# EasyEDA Pro project STM32单片机家电控制及家居环境监测系统.epro

# Schematic Schematic1
Assembly Variant: Basic; Board Name: Board1; Create Date: 2026-02-08; Page Name: P1; Project Name: STM32单片机家电控制及家居环境监测系统; Schematic Name: Schematic1; Update Date: 2026-02-09; BladeWidth: 10; Company: 嘉立创EDA; Page Size: A4; RegionStart: 1; ShowBorder: 1; TitleBlock: 1; TitleBlockPosition: 3; Version: V1.0; XRegionCount: 6; YRegionCount: 4
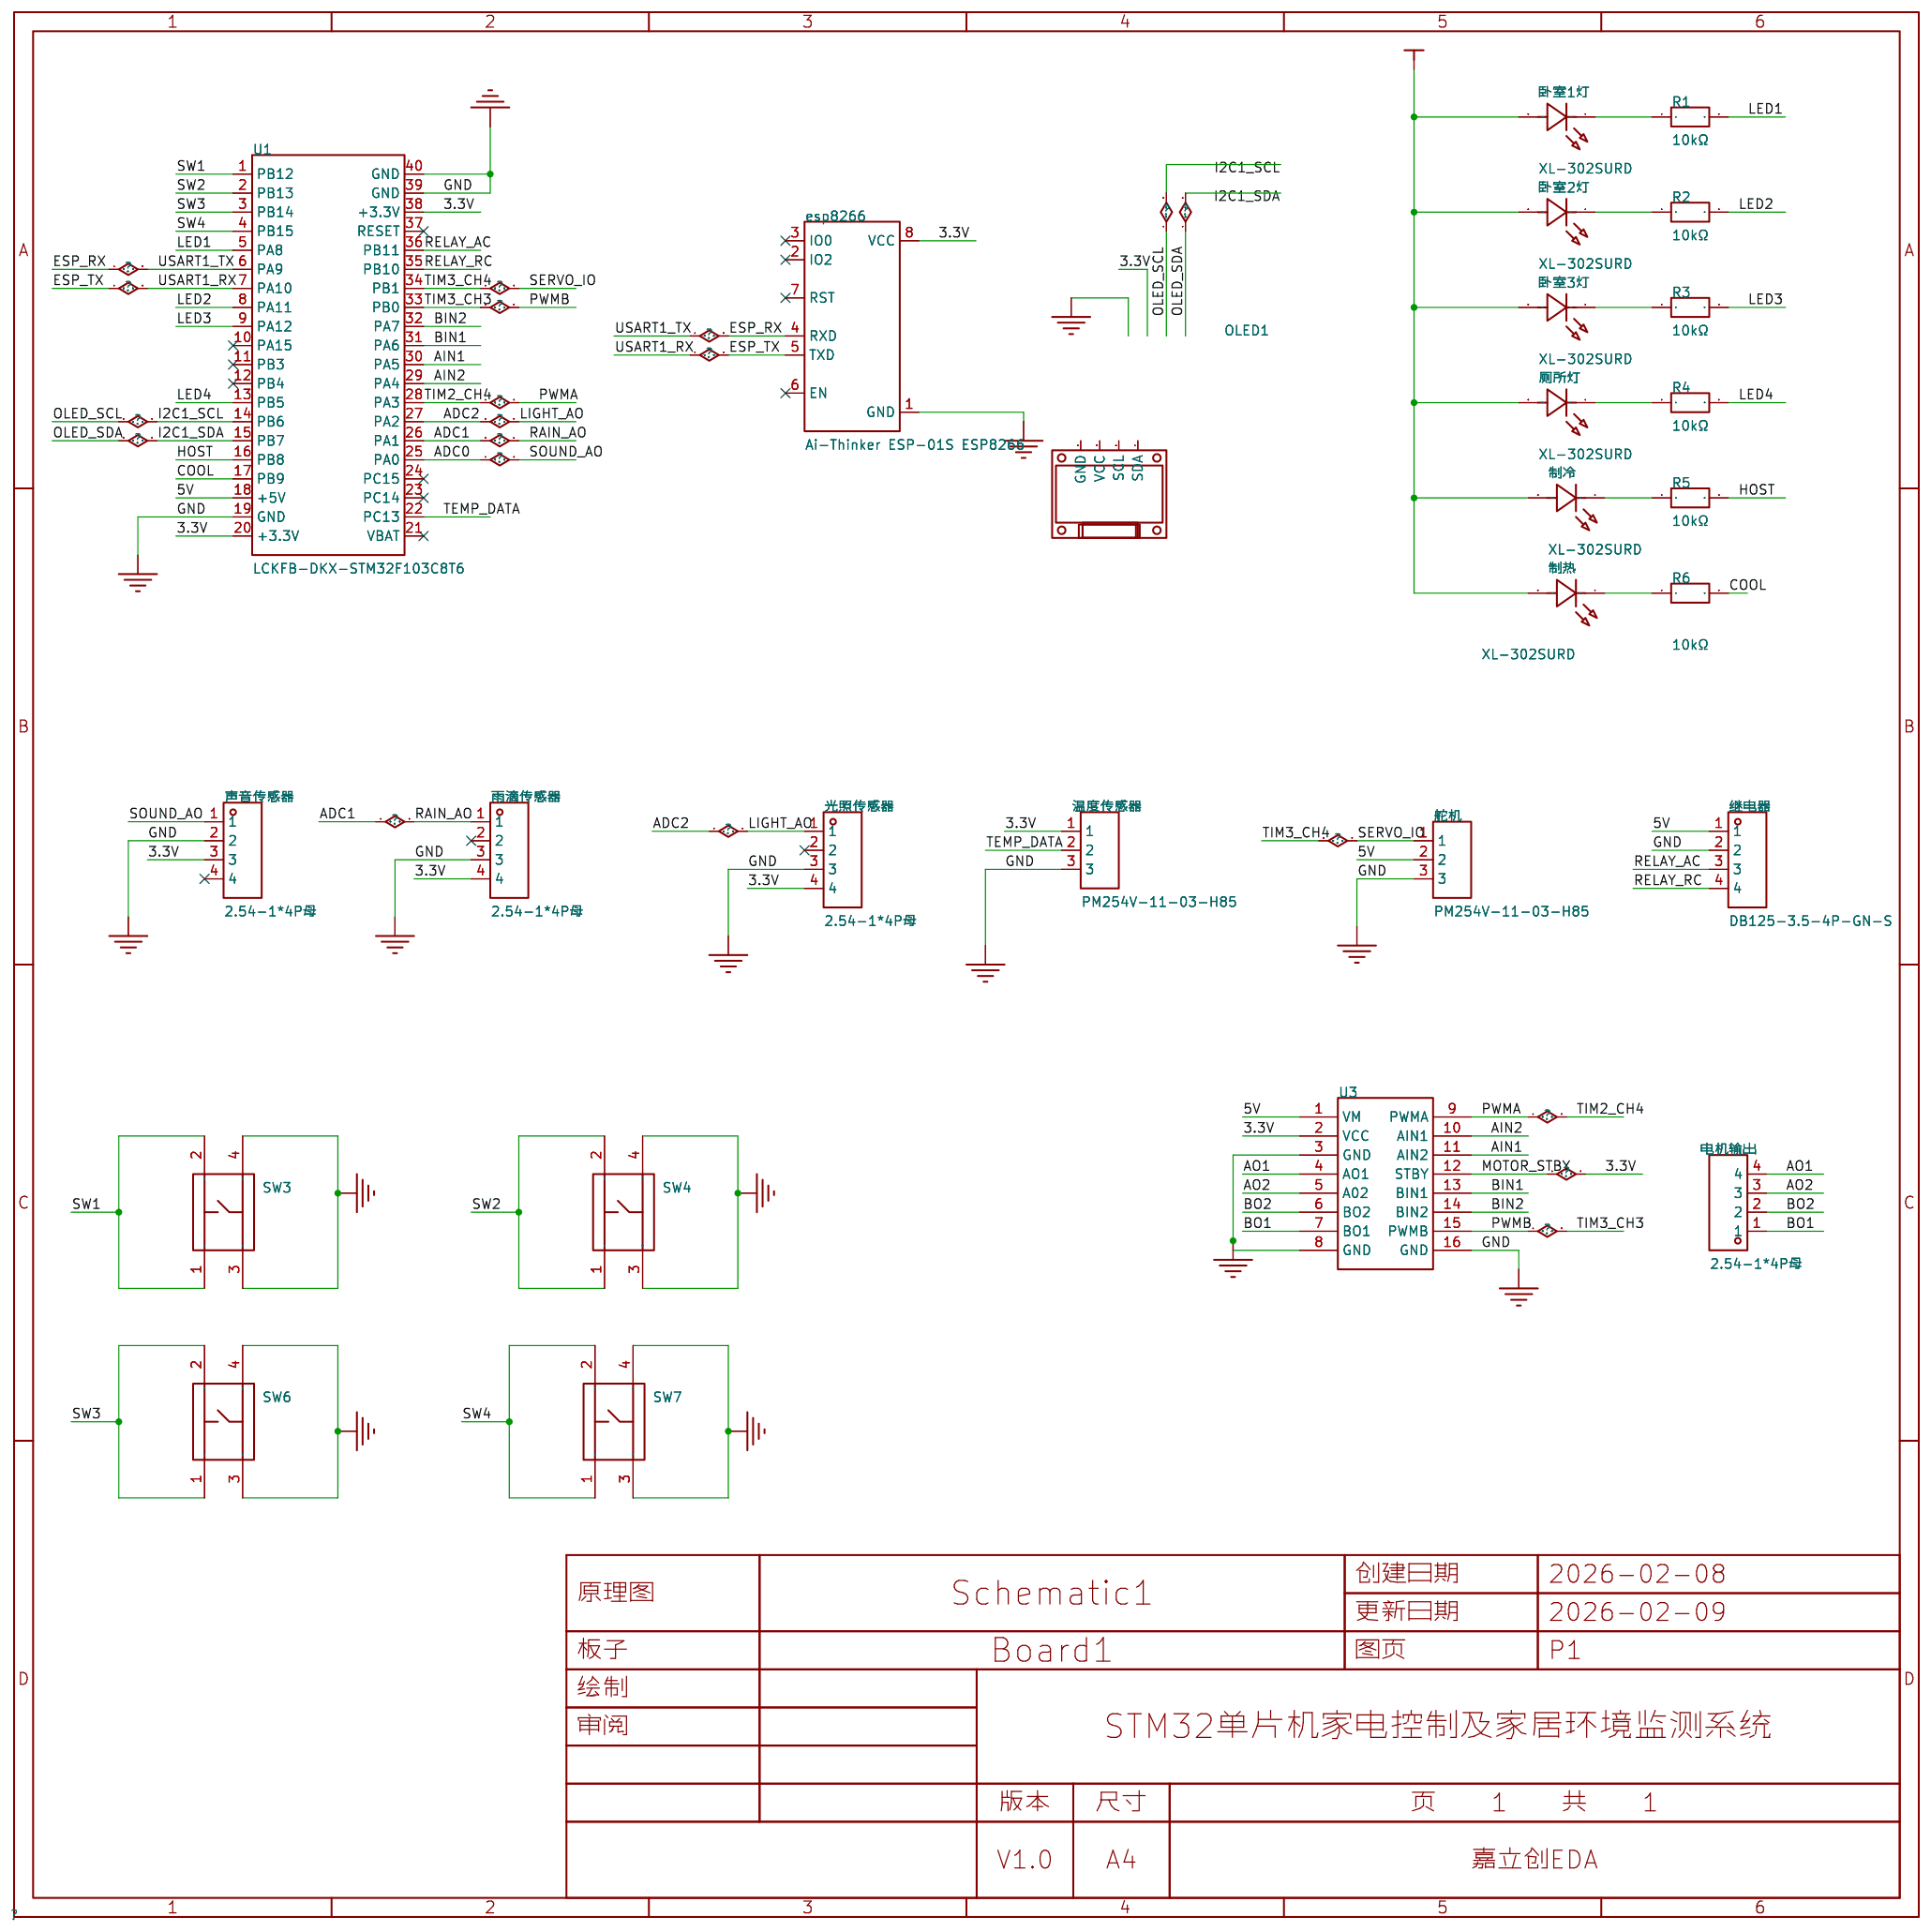
[diagram p0: schematic sheet]

## Parts
esp8266  Ai-Thinker ESP-01S ESP8266  [WIFIM-TH_8P-L24.7-W14.4-P2.54]
OLED1  -  [0.96OLED_4P]
R1  10kΩ  [RES-TH_BD2.7-L6.2-P10.20-D0.4]
R2  10kΩ  [RES-TH_BD2.7-L6.2-P10.20-D0.4]
R3  10kΩ  [RES-TH_BD2.7-L6.2-P10.20-D0.4]
R4  10kΩ  [RES-TH_BD2.7-L6.2-P10.20-D0.4]
R5  10kΩ  [RES-TH_BD2.7-L6.2-P10.20-D0.4]
R6  10kΩ  [RES-TH_BD2.7-L6.2-P10.20-D0.4]
SW3  K2-1102DP-C4SW-04  [KEY-TH_4P-L6.0-W6.0-P4.50-LS6.50]
SW4  K2-1102DP-C4SW-04  [KEY-TH_4P-L6.0-W6.0-P4.50-LS6.50]
SW6  K2-1102DP-C4SW-04  [KEY-TH_4P-L6.0-W6.0-P4.50-LS6.50]
SW7  K2-1102DP-C4SW-04  [KEY-TH_4P-L6.0-W6.0-P4.50-LS6.50]
U1  LCKFB-DKX-STM32F103C8T6  [CONN-TH_L53.3-W22.9_STM32F103C8T6-CARD]
U3  -  [TB6612]
光照传感器  2.54-1*4P母  [HDR-TH_4P-P2.54-V-F]
制冷  XL-302SURD  [LED-TH_BD3.8-P2.54-RD]
制热  XL-302SURD  [LED-TH_BD3.8-P2.54-RD]
卧室1灯  XL-302SURD  [LED-TH_BD3.8-P2.54-RD]
卧室2灯  XL-302SURD  [LED-TH_BD3.8-P2.54-RD]
卧室3灯  XL-302SURD  [LED-TH_BD3.8-P2.54-RD]
厕所灯  XL-302SURD  [LED-TH_BD3.8-P2.54-RD]
声音传感器  2.54-1*4P母  [HDR-TH_4P-P2.54-V-F]
温度传感器  PM254V-11-03-H85  [HDR-TH_3P-P2.54-V-F]
电机输出  2.54-1*4P母  [HDR-TH_4P-P2.54-V-F]
继电器  DB125-3.5-4P-GN-S  [CONN-TH_DB125-3.5-4P-GN]
舵机  PM254V-11-03-H85  [HDR-TH_3P-P2.54-V-F]
雨滴传感器  2.54-1*4P母  [HDR-TH_4P-P2.54-V-F]

## Library data of the parts
esp8266 = Ai-Thinker ESP-01S ESP8266: Supplier Part: C17606792; Manufacturer: Ai-Thinker(安信可); JLCPCB Part Class: Extended Part; Datasheet: https://item.szlcsc.com/datasheet/Ai-Thinker%2520ESP-01S%2520ESP8266/18736031.html; Supplier: LCSC
OLED1 = 0.96OLED模块_4P: Supplier Footprint: 插件
R1-R6 = MF1/4W-10K±1%-ST52: 电阻类型:金属膜电阻;阻值:10kΩ;精度:±1%;功率:250mW;温度系数:±100ppm/℃;; LCSC Part Name: 金属膜电阻 10kΩ ±1% 250mW; Supplier Part: C2903232; Manufacturer: VO(翔胜); Supplier Footprint: 插件,D2.7xL6.2mm; JLCPCB Part Class: Extended Part; Datasheet: https://item.szlcsc.com/datasheet/MF1%252F4W-10K%25C2%25B11%2525-ST52/3158983.html; Supplier: LCSC; Type: 金属膜电阻; Tolerance: ±1%; Voltage-Supply(Max): 250V; Power(Watts): 250mW; Temperature Coefficient: ±100ppm/℃; Operating Temperature: -55℃~+155℃
SW3 SW4 SW6 SW7 = K2-1102DP-C4SW-04: 电路结构:单刀单掷;按钮形状:圆形按钮;作用力:2.5N;安装方式:直插;开关长度:6mm;开关宽度:6mm;开关高度:5mm;触点电流:50mA;额定电压:12V;带灯:-;工作寿命:10万次;; LCSC Part Name: 轻触按键开关6*6*5; Supplier Part: C110153; Manufacturer: 韩国韩荣; Supplier Footprint: 插件-4P,6x6mm; JLCPCB Part Class: Extended Part; Datasheet: https://item.szlcsc.com/datasheet/K2-1102DP-C4SW-04/111374.html; Supplier: LCSC; Circuit: 单刀单掷; Actuator Style: 圆形按钮; Operating Force: 2.5N; Mounting Type: 直插; Length: 6mm; Width: 6mm; Switch Height: 5mm; Contact Current: 50mA; Voltage Rating: 12V; Life: 10万次; Operating Temperature: -25℃~+85℃
U1 = LCKFB-DKX-STM32F103C8T6: 搭载Contex M3内核,程序存储容量64KB,RAM总容量20KB,最高72MHz主频,提供高效的计算能力和稳定的运行环境。; LCSC Part Name: 立创·地阔星-STM32F103C8T6开发板; Supplier Part: C22396880; Manufacturer: 立创开发板; JLCPCB Part Class: Extended Part; Datasheet: https://item.szlcsc.com/datasheet/LCKFB-DKX-STM32F103C8T6/24005615.html; Supplier: LCSC
U3 = TB6612
光照传感器 声音传感器 电机输出 雨滴传感器 = 2.54-1*4P母: 插孔结构:1x4P;间距:2.54mm;行距:-;圆孔/方孔:方孔;安装方式:直插;排数:单排;总孔位数:4P;额定电流:3A;额定电压:-;插孔方向:顶部;塑高:-;触头材质:青铜;触头镀层:-;工作温度:-40℃~+105℃;; LCSC Part Name: 间距:2.54mm 1x4P 直插; Supplier Part: C2718488; Manufacturer: BOOMELE(博穆精密); Supplier Footprint: 插件,P=2.54mm; JLCPCB Part Class: Extended Part; Datasheet: https://item.szlcsc.com/datasheet/2.54-1*4P%25E6%25AF%258D/2834502.html; Supplier: LCSC; Holes Structure: 1x4P; Pitch: 2.54mm; Circular Hole / Square Hole: 方孔; Mounting Type: 直插; Number of Rows: 单排; Number of Positions: 4P; Current Rating: 3A; Holes Direction: 顶部; Contact Material: 青铜; Operating Temperature: -40℃~+105℃
制冷 制热 卧室1灯 卧室2灯 卧室3灯 厕所灯 = XL-302SURD: 灯头类型:3mm圆形灯头;发光颜色:红色;正向压降(Vf):2.2V;功率:50mW;正向电流:20mA;波长:620nm~630nm;二极管配置:-;透镜颜色:红色透镜;色温:-;发光强度:1000mcd;发光角度:35°;载带方式:-;工作温度:-20℃~+85℃;; LCSC Part Name: 3mm圆形灯头 红色; Supplier Part: C2895470; Manufacturer: XINGLIGHT(成兴光); Supplier Footprint: 插件,D=3mm; JLCPCB Part Class: Extended Part; Datasheet: https://item.szlcsc.com/datasheet/XL-302SURD/3136185.html; Supplier: LCSC; Lamp Holder Type: 3mm圆形灯头; Illumination Color: 红色; Voltage - Forward(Vf): 2.2V; Power(Watts): 50mW; Forward Current: 20mA; Wavelength - Dominant: 620nm~630nm; Peak Wavelength: 625nm; Lens Color: 红色透镜; Luminous Intensity: 1000mcd; Viewing Angle: 35°; Operating Temperature: -20℃~+85℃
温度传感器 舵机 = PM254V-11-03-H85: 插孔结构:1x3P;间距:2.54mm;行距:-;圆孔/方孔:方孔;安装方式:直插;排数:单排;总孔位数:3P;额定电流:3A;插孔方向:顶部;塑高:8.5mm;触头材质:黄铜;触头镀层:-;工作温度:-40℃~+105℃;; LCSC Part Name: 1x3P 间距:2.54mm 直插; Supplier Part: C541850; Manufacturer: XFCN(兴飞); Supplier Footprint: 插件,P=2.54mm; JLCPCB Part Class: Extended Part; Datasheet: https://item.szlcsc.com/datasheet/PM254V-11-03-H85/562471.html; Supplier: LCSC; Holes Structure: 1x3P; Pitch: 2.54mm; Circular Hole / Square Hole: 方孔; Mounting Type: 直插; Number of Rows: 单排; Number of Positions: 3P; Current Rating: 3A; Holes Direction: 顶部; Insulation Height: 8.5mm; Contact Material: 黄铜; Operating Temperature: -40℃~+105℃
继电器 = DB125-3.5-4P-GN-S: 结构:1x4P;间距:3.5mm;颜色:绿色;安装方式:直插;排数:1;每排PIN数:4;额定电流:10A;额定电压:300V;线规 - AWG:16~28;线规 - 平方毫米:1;工作温度:-40℃~+105℃;; LCSC Part Name: 1x4P 3.5mm 直插 排数:1 每排P数:4; Supplier Part: C2757925; Manufacturer: DORABO(地博电气); Supplier Footprint: 插件,P=3.5mm; JLCPCB Part Class: Extended Part; Datasheet: https://item.szlcsc.com/datasheet/DB125-3.5-4P-GN-S/2874766.html; Supplier: LCSC; Number of Positions or Pins: 1x4P; Pitch: 3.5mm; Color: 绿色; Mounting Type: 直插; Number of Pins: 4P; Number of Rows: 1; Number of PINs Per Row: 4; Screw Specification: M2; Current Rating: 10A; Voltage Rating (Max): 300V; Wire Gauge - AWG: 16~28; Wire Gauge - mm2: 1; Operating Temperature: -40℃~+105℃

## Nets
3.3V: esp8266.8(VCC) U1.20(+3.3V) U1.38(+3.3V) U3.2(VCC) U3.12(STBY) 光照传感器.4 制冷.2(A) 制热.2(A) 卧室1灯.2(A) 卧室2灯.2(A) 卧室3灯.2(A) 厕所灯.2(A) 声音传感器.3 温度传感器.1 雨滴传感器.4
5V: U1.18(+5V) U3.1(VM) 继电器.1 舵机.2
GND: esp8266.1(GND) SW3.3 SW3.4 SW4.3 SW4.4 SW6.3 SW6.4 SW7.3 SW7.4 U1.19(GND) U1.39(GND) U1.40(GND) U3.3(GND) U3.8(GND) U3.16(GND) 光照传感器.3 声音传感器.2 温度传感器.3 继电器.2 舵机.3 雨滴传感器.3
ADC0: U1.25(PA0) 声音传感器.1
ADC1: U1.26(PA1) 雨滴传感器.1
ADC2: U1.27(PA2) 光照传感器.1
AIN1: U1.30(PA5) U3.11(AIN2)
AIN2: U1.29(PA4) U3.10(AIN1)
AO1: U3.4(AO1) 电机输出.4
AO2: U3.5(A02) 电机输出.3
BIN1: U1.31(PA6) U3.13(BIN1)
BIN2: U1.32(PA7) U3.14(BIN2)
BO1: U3.7(BO1) 电机输出.1
BO2: U3.6(BO2) 电机输出.2
COOL: R6.2 U1.17(PB9)
ESP_RX: esp8266.4(RXD) U1.6(PA9)
ESP_TX: esp8266.5(TXD) U1.7(PA10)
HOST: R5.2 U1.16(PB8)
I2C1_SCL: U1.14(PB6)
I2C1_SDA: U1.15(PB7)
LED1: R1.2 U1.5(PA8)
LED2: R2.2 U1.8(PA11)
LED3: R3.2 U1.9(PA12)
LED4: R4.2 U1.13(PB5)
PWMA: U1.28(PA3) U3.9(PWMA)
PWMB: U1.33(PB0) U3.15(PWMB)
RELAY_AC: U1.36(PB11) 继电器.3
RELAY_RC: U1.35(PB10) 继电器.4
SERVO_IO: U1.34(PB1) 舵机.1
SW1: SW3.1 SW3.2 U1.1(PB12)
SW2: SW4.1 SW4.2 U1.2(PB13)
SW3: SW6.1 SW6.2 U1.3(PB14)
SW4: SW7.1 SW7.2 U1.4(PB15)
TEMP_DATA: U1.22(PC13) 温度传感器.2
$1N176: R4.1 厕所灯.1(K)
$1N177: R3.1 卧室3灯.1(K)
$1N178: R1.1 卧室1灯.1(K)
$1N179: R2.1 卧室2灯.1(K)
$1N193: R5.1 制冷.1(K)
$1N194: R6.1 制热.1(K)

Not connected (* = marked no-connect by the designer): esp8266 2(IO2)* 3(IO0)* 6(EN)* 7(RST)*; OLED1 1(GND) 2(VCC) 3(SCL) 4(SDA); U1 10(PA15)* 11(PB3)* 12(PB4)* 21(VBAT)* 23(PC14)* 24(PC15)* 37(RESET)*; 光照传感器 2*; 声音传感器 4*; 雨滴传感器 2*

# Board PCB1
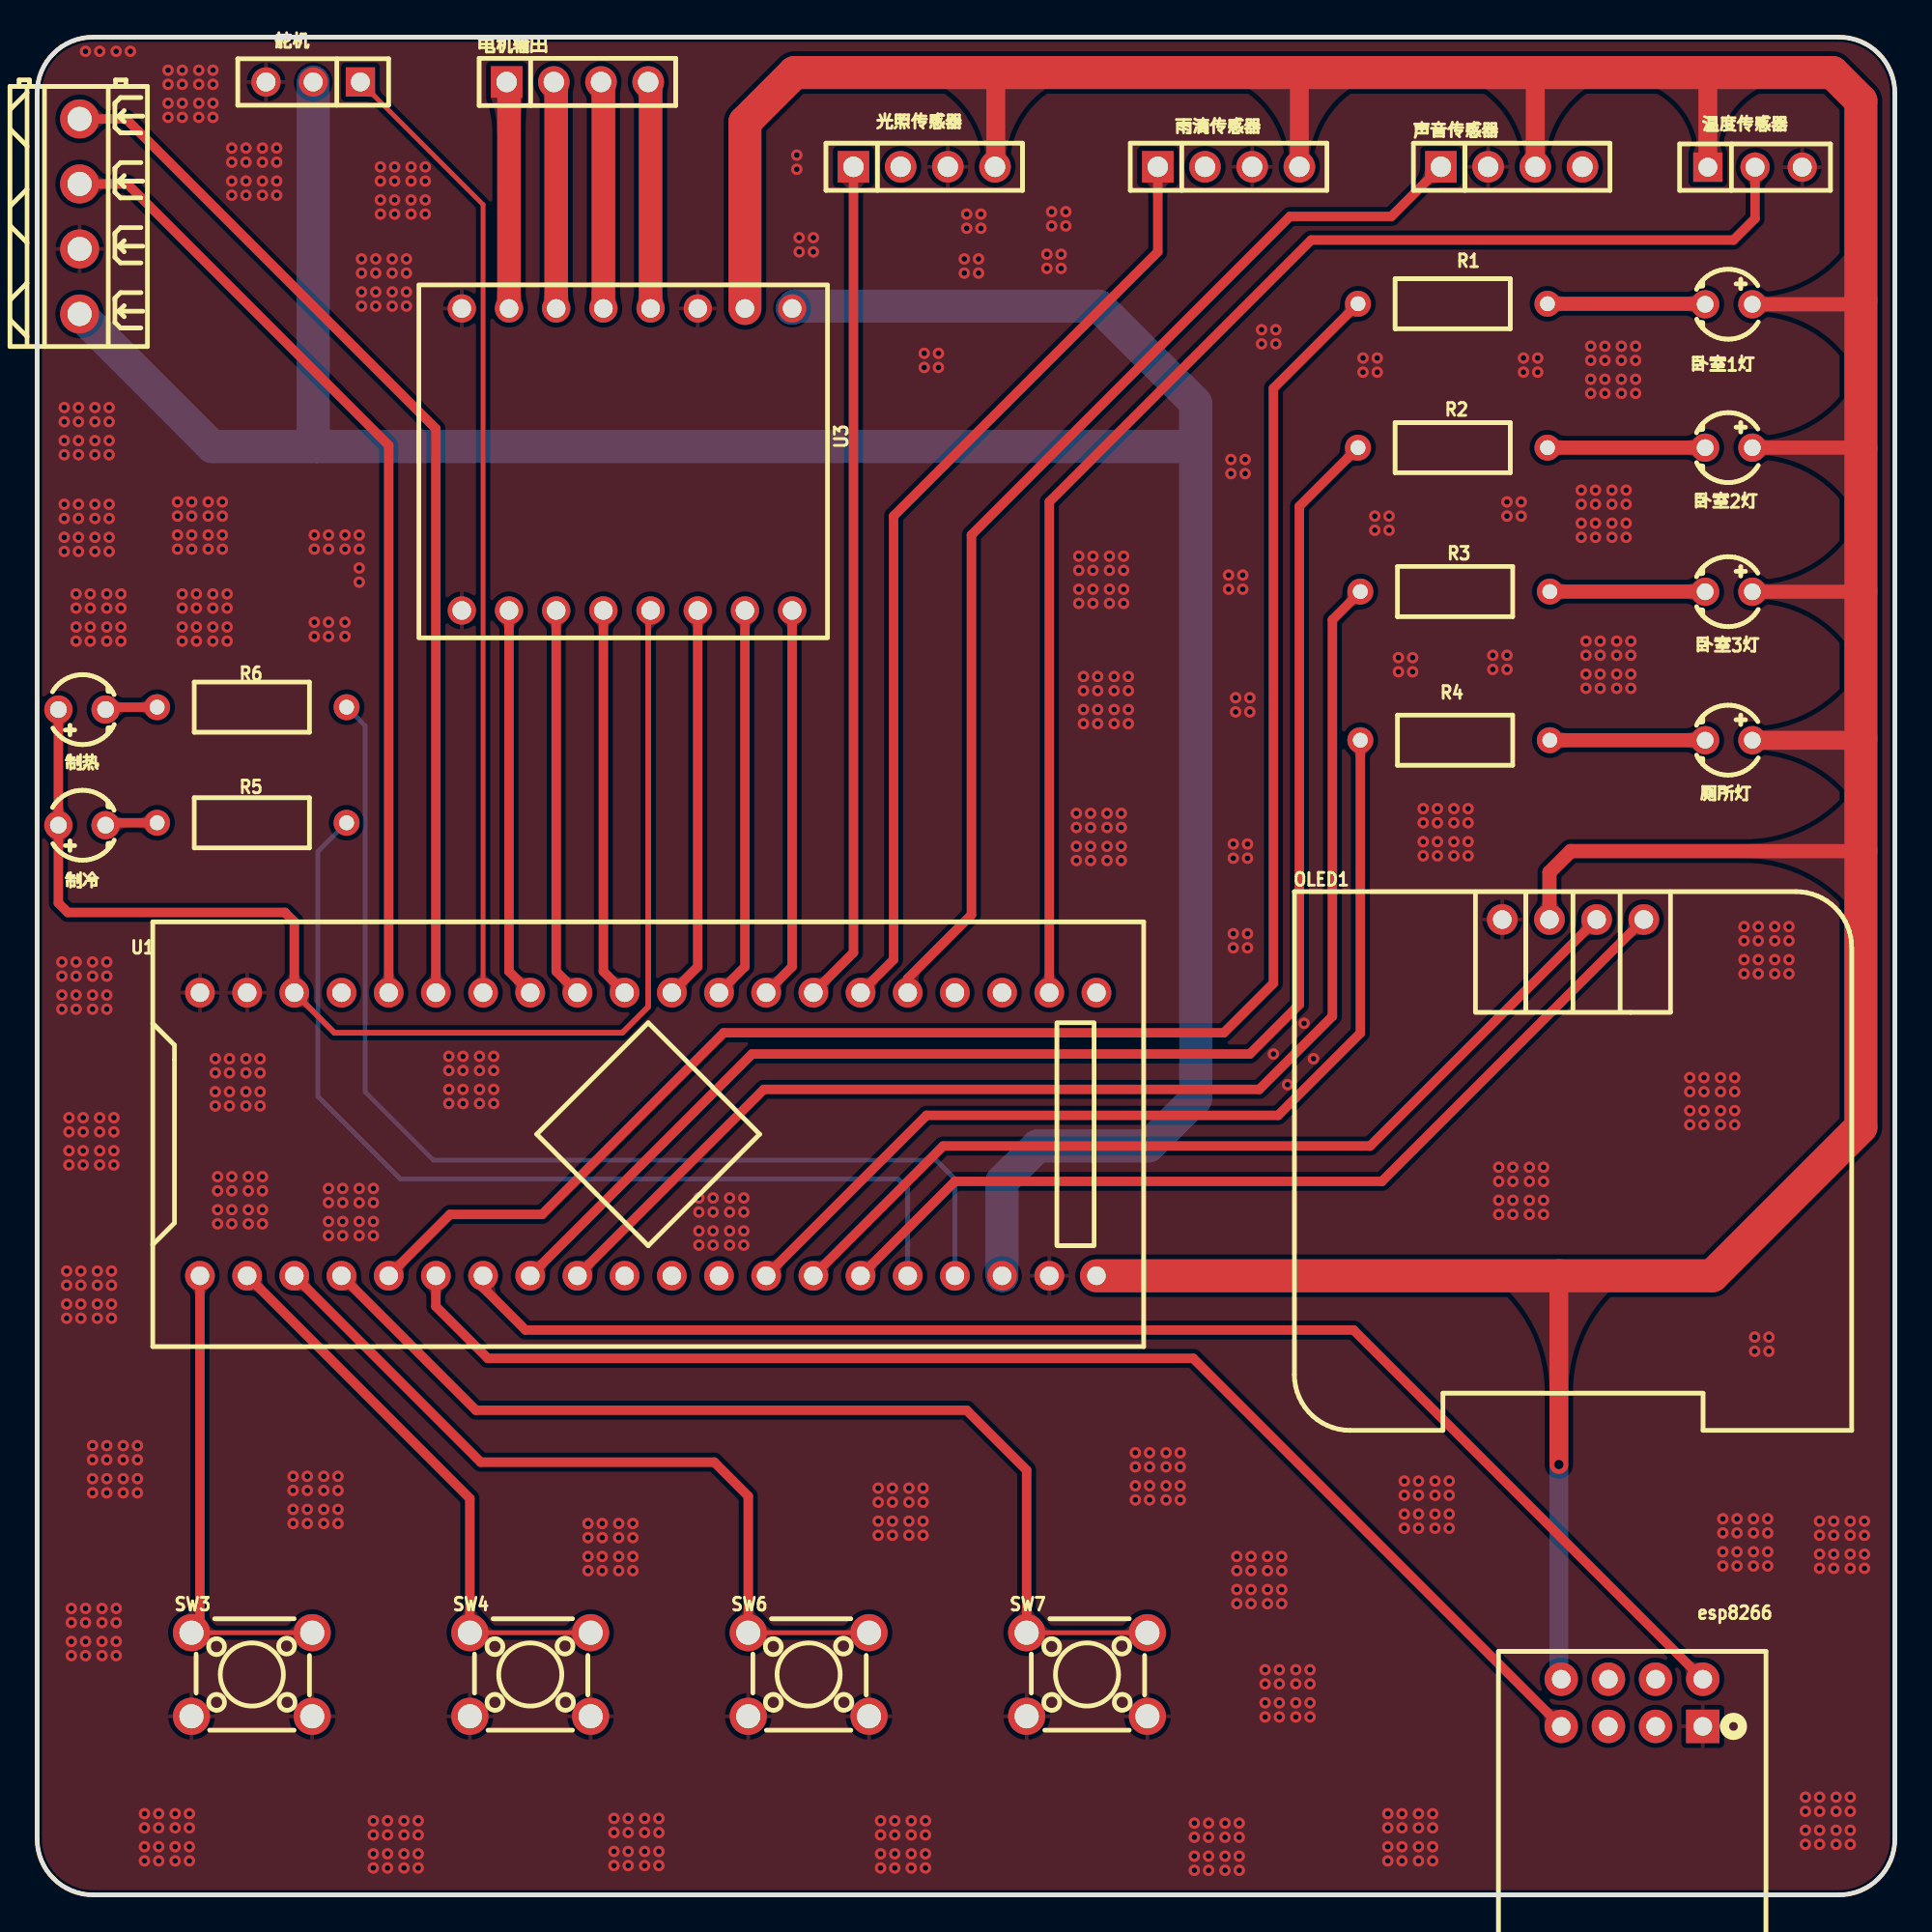
[diagram p1: board, top side]
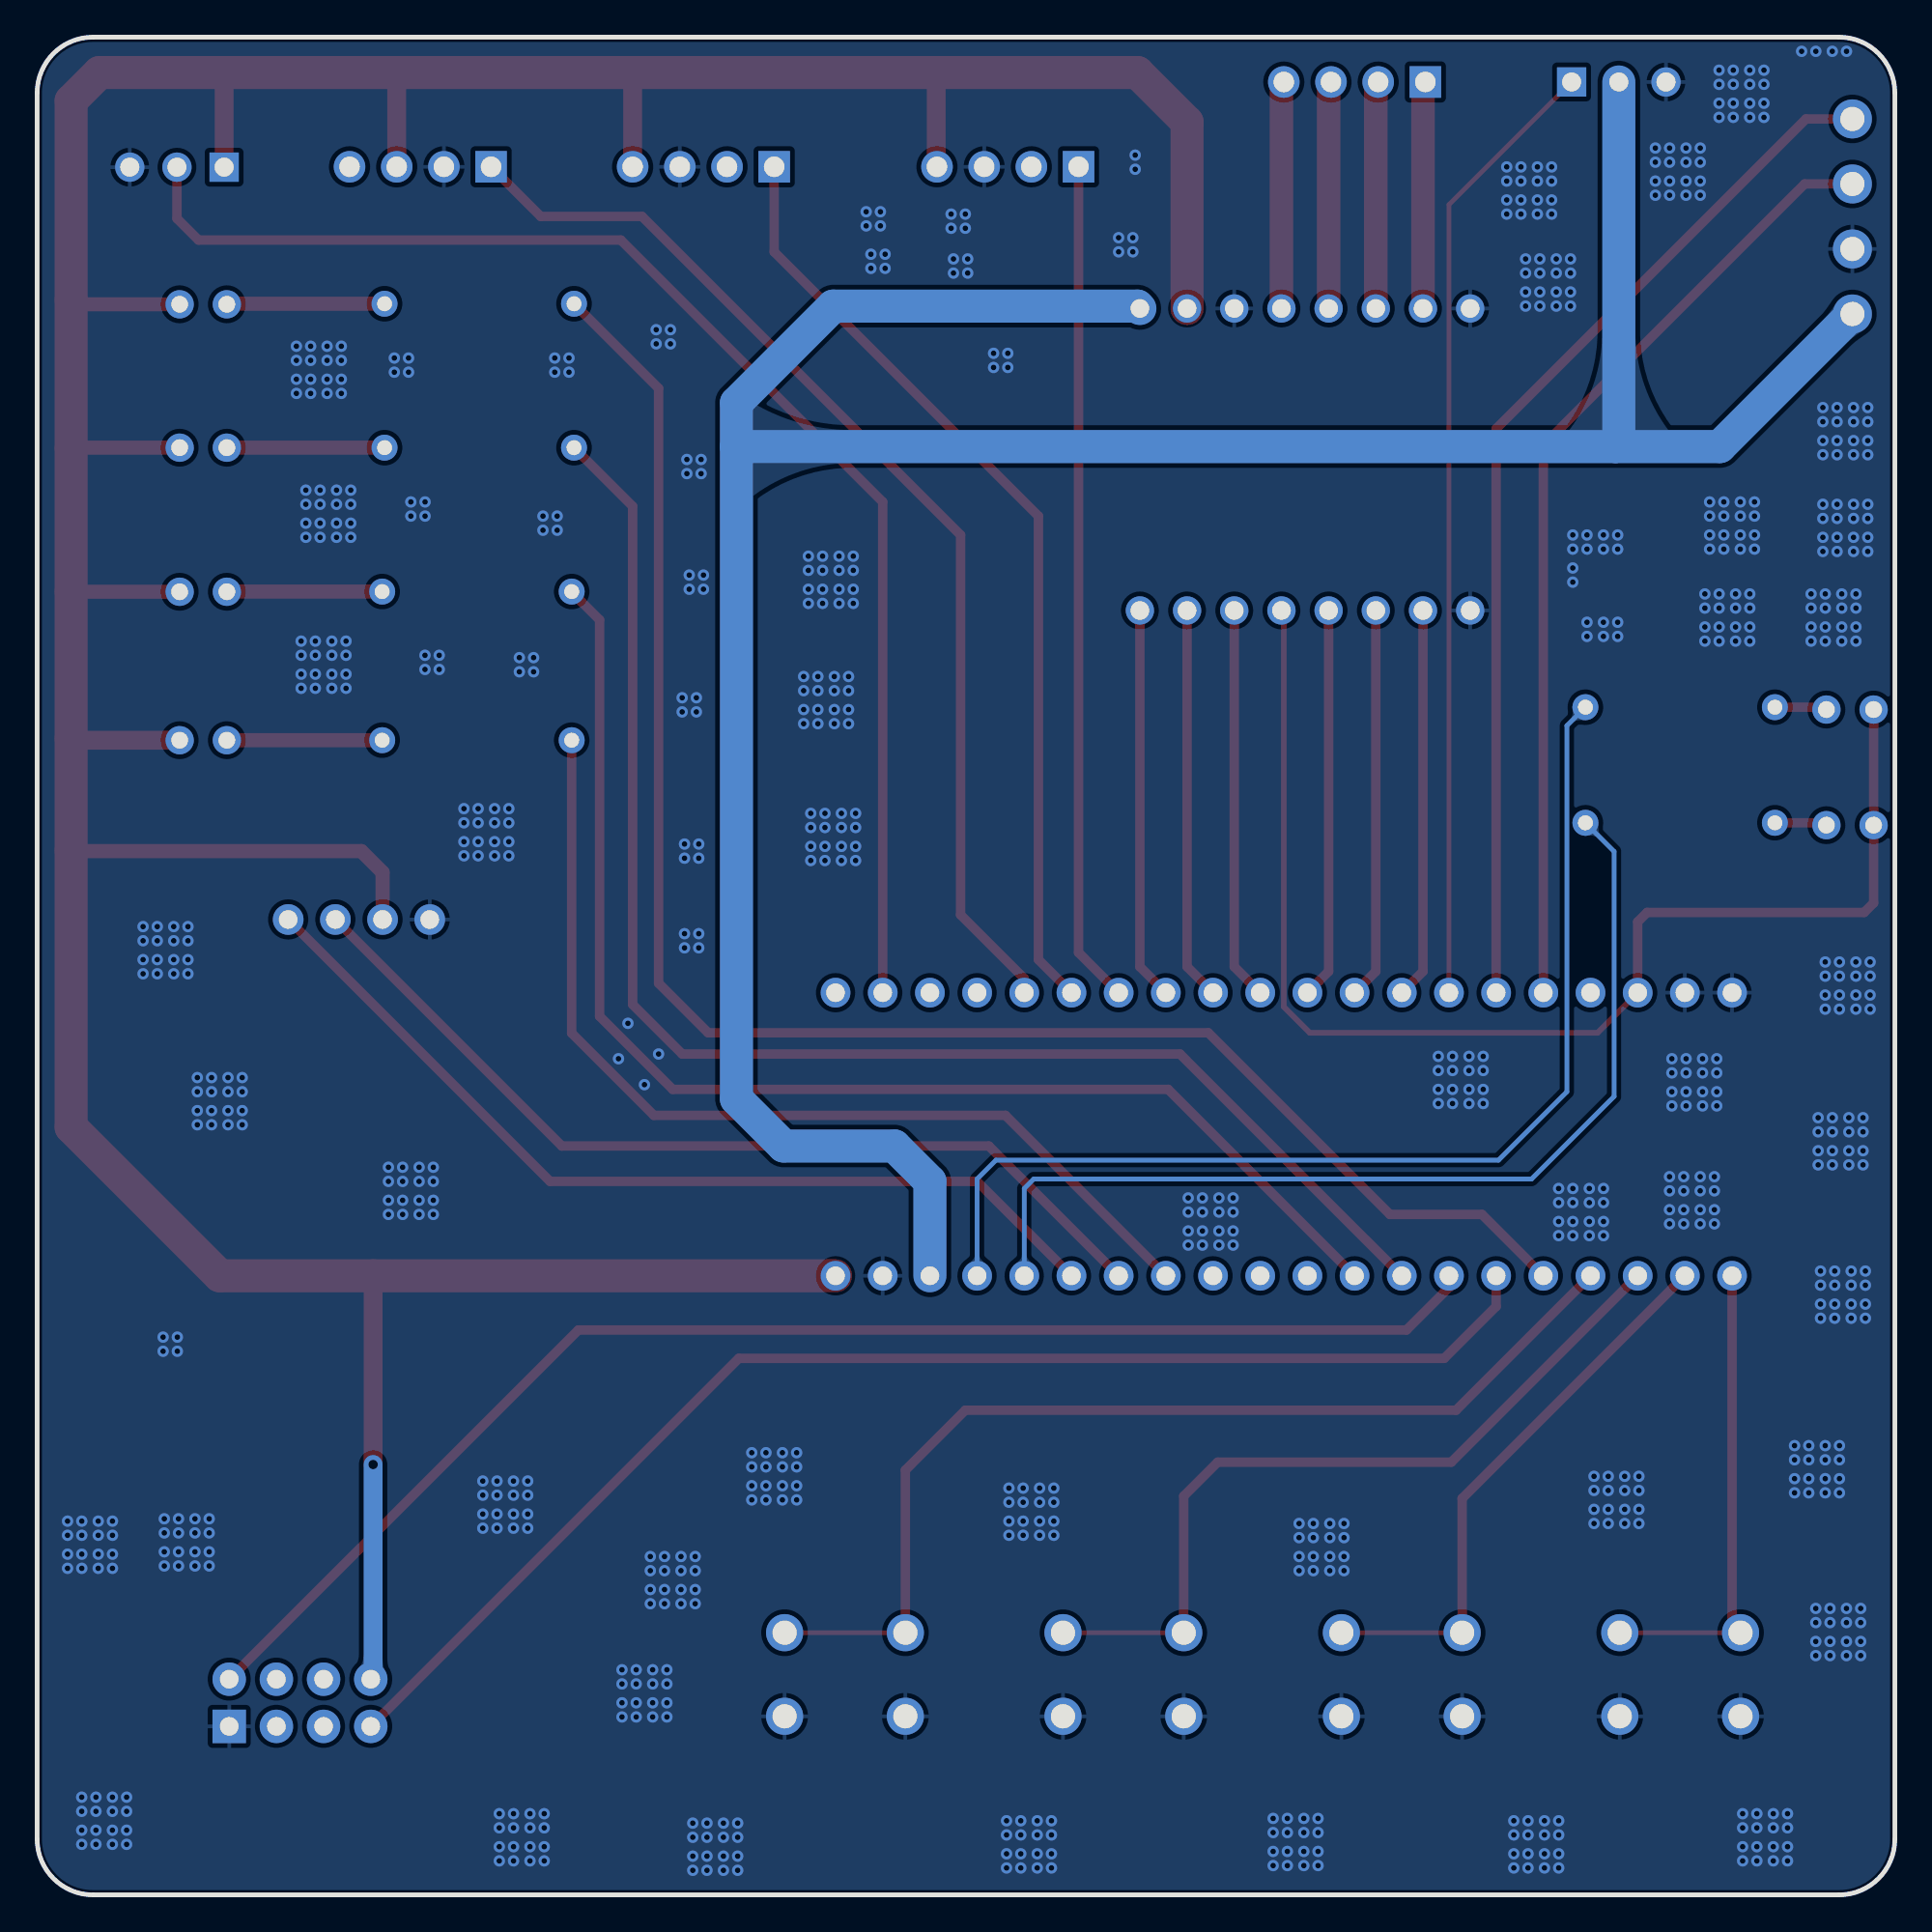
[diagram p2: board, bottom side, seen from below]

Outline 100 x 100 mm; copper layers: Top Layer, Bottom Layer. Coordinates in mm from the lower left corner of the outline.
Outline path: 0,97 0,3 arc(0.88,0.88) 3,0 97,0 arc(99.12,0.88) 100,3 100,97 arc(99.12,99.12) 97,100 3,100 arc(0.88,99.12) 0,97
Stack: Top Layer 0.035mm / Dielectric1 1.51mm FR4 er 4.5 / Bottom Layer 0.035mm

## Design rules (mm)
spacing copperThickness1oz (default): track to track 0.102, other pairs 0.152 to 0.3
spacing copperThickness2oz: track to track 0.203, other pairs 0.152 to 0.3
track width copperThickness1oz (default): min 0.127, default 0.254, max 2.54
track width copperThickness2oz: min 0.203, default 0.254, max 2.54
differential pair differentialPair (default): width min 0.127, default 0.254, max 2.54; gap min 0.152, default 0.152
net GND uses copperRegion

## Placement (name value [footprint] x y rotation side)
esp8266  Ai-Thinker ESP-01S ESP8266  [WIFIM-TH_8P-L24.7-W14.4-P2.54]  85.85 10.34 270 top
OLED1  -  [0.96OLED_4P]  82.68 52.5 0 top
R1  10kΩ  [RES-TH_BD2.7-L6.2-P10.20-D0.4]  76.2 85.65 180 top
R2  10kΩ  [RES-TH_BD2.7-L6.2-P10.20-D0.4]  76.2 77.9 180 top
R3  10kΩ  [RES-TH_BD2.7-L6.2-P10.20-D0.4]  76.33 70.16 180 top
R4  10kΩ  [RES-TH_BD2.7-L6.2-P10.20-D0.4]  76.33 62.15 180 top
R5  10kΩ  [RES-TH_BD2.7-L6.2-P10.20-D0.4]  11.56 57.71 0 top
R6  10kΩ  [RES-TH_BD2.7-L6.2-P10.20-D0.4]  11.56 63.93 0 top
SW3  K2-1102DP-C4SW-04  [KEY-TH_4P-L6.0-W6.0-P4.50-LS6.50]  11.56 11.86 0 top
SW4  K2-1102DP-C4SW-04  [KEY-TH_4P-L6.0-W6.0-P4.50-LS6.50]  26.54 11.86 0 top
SW6  K2-1102DP-C4SW-04  [KEY-TH_4P-L6.0-W6.0-P4.50-LS6.50]  41.53 11.86 0 top
SW7  K2-1102DP-C4SW-04  [KEY-TH_4P-L6.0-W6.0-P4.50-LS6.50]  56.51 11.86 0 top
U1  LCKFB-DKX-STM32F103C8T6  [CONN-TH_L53.3-W22.9_STM32F103C8T6-CARD]  32.89 40.94 0 top
U3  -  [TB6612]  42.54 86.67 270 top
光照传感器  2.54-1*4P母  [HDR-TH_4P-P2.54-V-F]  47.75 93.02 0 top
制冷  XL-302SURD  [LED-TH_BD3.8-P2.54-RD]  2.41 57.58 180 top
制热  XL-302SURD  [LED-TH_BD3.8-P2.54-RD]  2.41 63.81 180 top
卧室1灯  XL-302SURD  [LED-TH_BD3.8-P2.54-RD]  91.06 85.62 0 top
卧室2灯  XL-302SURD  [LED-TH_BD3.8-P2.54-RD]  91.06 77.9 0 top
卧室3灯  XL-302SURD  [LED-TH_BD3.8-P2.54-RD]  91.06 70.15 0 top
厕所灯  XL-302SURD  [LED-TH_BD3.8-P2.54-RD]  91.06 62.15 0 top
声音传感器  2.54-1*4P母  [HDR-TH_4P-P2.54-V-F]  79.38 93.02 0 top
温度传感器  PM254V-11-03-H85  [HDR-TH_3P-P2.54-V-F]  92.47 93 0 top
电机输出  2.54-1*4P母  [HDR-TH_4P-P2.54-V-F]  29.08 97.59 0 top
继电器  DB125-3.5-4P-GN-S  [CONN-TH_DB125-3.5-4P-GN]  2.29 90.35 90 top
舵机  PM254V-11-03-H85  [HDR-TH_3P-P2.54-V-F]  14.86 97.59 180 top
雨滴传感器  2.54-1*4P母  [HDR-TH_4P-P2.54-V-F]  64.13 93.02 0 top

## Footprints (pads in the part's own frame, mm; a bottom-side part is the same pattern mirrored in y, then rotated)
0.96OLED_4P
  round 1.65 hole 1: 1(-3.81,-0.002) 2(-1.27,0.002) 3(1.27,0.002) 4(3.81,0.002)
CONN-TH_DB125-3.5-4P-GN
  round 2.1 hole 1.3: 1(-5.25,0) 2(-1.75,0) 3(1.75,0) 4(5.25,0)
CONN-TH_L53.3-W22.9_STM32F103C8T6-CARD
  round 1.6 hole 1: 1(-24.13,-7.62) 2(-21.59,-7.62) 3(-19.05,-7.62) 4(-16.51,-7.62) 5(-13.97,-7.62) 6(-11.43,-7.62) 7(-8.89,-7.62) 8(-6.35,-7.62) 9(-3.81,-7.62) 10(-1.27,-7.62) 11(1.27,-7.62) 12(3.81,-7.62) 13(6.35,-7.62) 14(8.89,-7.62) 15(11.43,-7.62) 16(13.97,-7.62) 17(16.51,-7.62) 18(19.05,-7.62) 19(21.59,-7.62) 20(24.13,-7.62) 21(24.13,7.62) 22(21.59,7.62) 23(19.05,7.62) 24(16.51,7.62) 25(13.97,7.62) 26(11.43,7.62) 27(8.89,7.62) 28(6.35,7.62) 29(3.81,7.62) 30(1.27,7.62) 31(-1.27,7.62) 32(-3.81,7.62) 33(-6.35,7.62) 34(-8.89,7.62) 35(-11.43,7.62) 36(-13.97,7.62) 37(-16.51,7.62) 38(-19.05,7.62) 39(-21.59,7.62) 40(-24.13,7.62)
HDR-TH_3P-P2.54-V-F
  rect 1.575x1.575 hole 1.02: 1(-2.54,0)
  round 1.575 hole 1.02: 2(0,0) 3(2.54,0)
HDR-TH_4P-P2.54-V-F
  rect 1.7x1.7 hole 1.1: 1(-3.81,0)
  round 1.7 hole 1.1: 2(-1.27,0) 3(1.27,0) 4(3.81,0)
KEY-TH_4P-L6.0-W6.0-P4.50-LS6.50
  round 2 hole 1.3: 1(-3.25,2.25) 2(3.25,2.25) 3(-3.25,-2.25) 4(3.25,-2.25)
LED-TH_BD3.8-P2.54-RD
  round 1.524 hole 0.9: 1(-1.27,0) 2(1.27,0)
RES-TH_BD2.7-L6.2-P10.20-D0.4
  round 1.4 hole 0.8: 1(-5.1,0) 2(5.1,0)
TB6612
  round 1.524 hole 1: 1(1.27,-1.905) 2(1.27,-4.445) 3(1.27,-6.985) 4(1.27,-9.525) 5(1.27,-12.065) 6(1.27,-14.605) 7(1.27,-17.145) 8(1.27,-19.685) 9(17.526,-1.905) 10(17.526,-4.445) 11(17.526,-6.985) 12(17.526,-9.525) 13(17.526,-12.065) 14(17.526,-14.605) 15(17.526,-17.145) 16(17.526,-19.685)
WIFIM-TH_8P-L24.7-W14.4-P2.54
  rect 1.8x1.8 hole 1: 1(1.27,3.81)
  round 1.8 hole 1: 2(1.27,1.27) 3(1.27,-1.27) 4(1.27,-3.81) 5(-1.27,3.81) 6(-1.27,1.27) 7(-1.27,-1.27) 8(-1.27,-3.81)

## Nets
As in the schematic, except:
3.3V: esp8266.8 OLED1.2 U1.20 U1.38 U3.2 U3.12 光照传感器.4 制冷.2 制热.2 卧室1灯.2 卧室2灯.2 卧室3灯.2 厕所灯.2 声音传感器.3 温度传感器.1 雨滴传感器.4
GND: esp8266.1 OLED1.1 SW3.3 SW3.4 SW4.3 SW4.4 SW6.3 SW6.4 SW7.3 SW7.4 U1.19 U1.39 U1.40 U3.3 U3.8 U3.16 光照传感器.3 声音传感器.2 温度传感器.3 继电器.2 舵机.3 雨滴传感器.3
I2C1_SCL: OLED1.3 U1.14
I2C1_SDA: OLED1.4 U1.15

Pads without a net: esp8266 2 3 6 7; U1 10 11 12 21 23 24 37; 光照传感器 2; 声音传感器 4; 雨滴传感器 2

## Via types
v1: diameter 0.61, hole 0.305, Top Layer to Bottom Layer, 822 vias
v2: diameter 0.889, hole 0.508, Top Layer to Bottom Layer, 1 via

## Routing (per net, layer and track width the routed paths; a pad name or vN(x,y) marks a point on that pad's centre or on a via; arc(x,y) is an arc through that point)
3.3V: length 325.6
  Top Layer w0.305: U1.38 16,46.41 31.5,46.41 32.89,47.8 32.89,69.01 U3.12
  Top Layer w0.508: U1.38 13.84,52.38 13.33,52.88 1.65,52.88 1.14,53.39 制冷.2 制热.2
  Top Layer w0.762: 98.17,70.17 98.15,70.15 92.47,70.15 92.47,70.16 ; 92.47,85.62 97.94,85.62 98.17,85.85 ; 92.47,77.9 98.15,77.9 98.17,77.88 ; 98.17,56.2 98.15,56.19 82.55,56.19 81.41,55.04 81.41,52.5
  Top Layer w1.016: 雨滴传感器.4 67.94,98.35 ; 厕所灯.2 98.07,62.15 98.17,62.25 ; 89.93,93.55 89.93,97.98 90.04,98.09 ; 51.6,98.09 51.6,93.06 光照传感器.4 ; 81.91,33.33 v2(81.91,23.16) ; 声音传感器.3 80.65,98.09
  Top Layer w1.778: U3.2 38.1,95.43 40.77,98.09 96.65,98.09 98.17,96.57 98.17,41.33 90.17,33.33 U1.20
  Bottom Layer w1.016: esp8266.8 81.91,11.74 v2(81.91,23.16)
5V: length 161.5
  Bottom Layer w1.778: 继电器.1 9.42,77.96 15.05,77.96 ; 62.36,77.96 62.36,80.31 57.15,85.52 40.77,85.52 U3.1 ; 62.36,77.96 62.36,42.85 59.82,40.31 53.85,40.31 51.94,38.41 U1.18 ; 62.36,77.96 15.05,77.96 ; 舵机.2 14.86,78.16 15.05,77.96
GND:
  vias: v1(1.33,50.22) v1(1.33,49.45) v1(1.33,48.44) v1(1.33,47.68) v1(1.46,80.06) v1(1.46,79.3) v1(1.46,78.28) v1(1.46,77.52) v1(1.46,74.85) v1(1.46,74.09) v1(1.46,73.08) v1(1.46,72.31) v1(1.59,33.58) v1(1.59,32.82) v1(1.59,31.8) v1(1.59,31.04) v1(1.71,41.83) v1(1.71,41.07) v1(1.71,40.06) v1(1.71,39.29) v1(1.84,15.42) v1(1.84,14.66) v1(1.84,13.64) v1(1.84,12.88) v1(2.09,70.03) v1(2.09,69.27) v1(2.09,68.25) v1(2.09,67.49) v1(2.1,50.22) v1(2.1,49.45) v1(2.1,48.44) v1(2.1,47.68) v1(2.22,80.06) v1(2.22,79.3) v1(2.22,78.28) v1(2.22,77.52) v1(2.22,74.85) v1(2.22,74.09) v1(2.22,73.08) v1(2.22,72.31) v1(2.35,33.58) v1(2.35,32.82) v1(2.35,31.8) v1(2.35,31.04) v1(2.48,41.83) v1(2.48,41.07) v1(2.48,40.06) v1(2.48,39.29) v1(2.6,99.24) v1(2.61,15.42) v1(2.61,14.66) v1(2.61,13.64) v1(2.61,12.88) v1(2.86,70.03) v1(2.86,69.27) v1(2.86,68.25) v1(2.86,67.49) v1(2.98,50.22) v1(2.98,49.45) v1(2.98,48.44) v1(2.98,47.68) v1(2.98,24.18) v1(2.98,23.42) v1(2.98,22.4) v1(2.98,21.64) v1(3.11,80.06) v1(3.11,79.3) v1(3.11,78.28) v1(3.11,77.52) v1(3.11,74.85) v1(3.11,74.09) v1(3.11,73.08) v1(3.11,72.31) v1(3.24,33.58) v1(3.24,32.82) v1(3.24,31.8) v1(3.24,31.04) v1(3.37,99.24) v1(3.36,41.83) v1(3.36,41.07) v1(3.36,40.06) v1(3.36,39.29) v1(3.49,15.42) v1(3.49,14.66) v1(3.49,13.64) v1(3.49,12.88) v1(3.74,70.03) v1(3.74,69.27) v1(3.74,68.25) v1(3.74,67.49) v1(3.75,50.22) v1(3.75,49.45) v1(3.75,48.44) v1(3.75,47.68) v1(3.75,24.18) v1(3.75,23.42) v1(3.75,22.4) v1(3.75,21.64) v1(3.88,80.06) v1(3.88,79.3) v1(3.88,78.28) v1(3.88,77.52) v1(3.88,74.85) v1(3.88,74.09) v1(3.88,73.08) v1(3.88,72.31) v1(4,33.58) v1(4,32.82) v1(4,31.8) v1(4,31.04) v1(4.13,41.83) v1(4.13,41.07) v1(4.13,40.06) v1(4.13,39.29) v1(4.25,99.24) v1(4.26,15.42) v1(4.26,14.66) v1(4.26,13.64) v1(4.26,12.88) v1(4.51,70.03) v1(4.51,69.27) v1(4.51,68.25) v1(4.51,67.49) v1(4.63,24.18) v1(4.63,23.42) v1(4.63,22.4) v1(4.63,21.64) v1(5.02,99.24) v1(5.4,24.18) v1(5.4,23.42) v1(5.4,22.4) v1(5.4,21.64) v1(5.78,4.37) v1(5.78,3.61) v1(5.78,2.59) v1(5.78,1.83) v1(6.54,4.37) v1(6.54,3.61) v1(6.54,2.59) v1(6.54,1.83) v1(7.05,98.22) v1(7.05,97.46) v1(7.05,96.44) v1(7.05,95.68) v1(7.43,4.37) v1(7.43,3.61) v1(7.43,2.59) v1(7.43,1.83) v1(7.55,74.98) v1(7.55,74.22) v1(7.55,73.2) v1(7.55,72.44) v1(7.81,98.22) v1(7.81,97.46) v1(7.81,96.44) v1(7.81,95.68) v1(7.81,70.03) v1(7.81,69.27) v1(7.81,68.25) v1(7.81,67.49) v1(8.19,4.37) v1(8.19,3.61) v1(8.19,2.59) v1(8.19,1.83) v1(8.32,74.98) v1(8.32,74.22) v1(8.32,73.2) v1(8.32,72.44) v1(8.57,70.03) v1(8.57,69.27) v1(8.57,68.25) v1(8.57,67.49) v1(8.7,98.22) v1(8.7,97.46) v1(8.7,96.44) v1(8.7,95.68) v1(9.21,74.98) v1(9.21,74.22) v1(9.21,73.2) v1(9.21,72.44) v1(9.46,98.22) v1(9.46,97.46) v1(9.46,96.44) v1(9.46,95.68) v1(9.46,70.03) v1(9.46,69.27) v1(9.46,68.25) v1(9.46,67.49) v1(9.59,45.01) v1(9.59,44.25) v1(9.59,43.23) v1(9.59,42.47) v1(9.71,38.66) v1(9.71,37.9) v1(9.71,36.88) v1(9.71,36.12) v1(9.97,74.98) v1(9.97,74.22) v1(9.97,73.2) v1(9.97,72.44) v1(10.23,70.03) v1(10.23,69.27) v1(10.23,68.25) v1(10.23,67.49) v1(10.35,45.01) v1(10.35,44.25) v1(10.35,43.23) v1(10.35,42.47) v1(10.48,94.03) v1(10.48,93.27) v1(10.48,92.25) v1(10.48,91.49) v1(10.48,38.66) v1(10.48,37.9) v1(10.48,36.88) v1(10.48,36.12) v1(11.24,94.03) v1(11.24,93.27) v1(11.24,92.25) v1(11.24,91.49) v1(11.24,45.01) v1(11.24,44.25) v1(11.24,43.23) v1(11.24,42.47) v1(11.36,38.66) v1(11.36,37.9) v1(11.36,36.88) v1(11.36,36.12) v1(12,45.01) v1(12,44.25) v1(12,43.23) v1(12,42.47) v1(12.13,94.03) v1(12.13,93.27) v1(12.13,92.25) v1(12.13,91.49) v1(12.13,38.66) v1(12.13,37.9) v1(12.13,36.88) v1(12.13,36.12) v1(12.89,94.03) v1(12.89,93.27) v1(12.89,92.25) v1(12.89,91.49) v1(13.78,22.53) v1(13.78,21.77) v1(13.78,20.75) v1(13.78,19.99) v1(14.54,22.53) v1(14.54,21.77) v1(14.54,20.75) v1(14.54,19.99) v1(14.92,73.2) v1(14.92,72.44) v1(14.92,68.5) v1(14.92,67.74) v1(15.43,22.53) v1(15.43,21.77) v1(15.43,20.75) v1(15.43,19.99) v1(15.69,73.2) v1(15.69,72.44) v1(15.69,68.5) v1(15.69,67.74) v1(15.68,38.02) v1(15.68,37.26) v1(15.68,36.25) v1(15.68,35.48) v1(16.19,22.53) v1(16.19,21.77) v1(16.19,20.75) v1(16.19,19.99) v1(16.45,38.02) v1(16.45,37.26) v1(16.45,36.25) v1(16.45,35.48) v1(16.57,73.2) v1(16.57,72.44) v1(16.57,68.5) v1(16.57,67.74) v1(17.34,73.2) v1(17.34,72.44) v1(17.34,71.42) v1(17.34,70.66) v1(17.33,38.02) v1(17.33,37.26) v1(17.33,36.25) v1(17.33,35.48) v1(17.46,88.06) v1(17.46,87.3) v1(17.46,86.28) v1(17.46,85.52) v1(18.1,38.02) v1(18.1,37.26) v1(18.1,36.25) v1(18.1,35.48) v1(18.1,3.99) v1(18.1,3.23) v1(18.1,2.21) v1(18.1,1.45) v1(18.23,88.06) v1(18.23,87.3) v1(18.23,86.28) v1(18.23,85.52) v1(18.48,93.02) v1(18.48,92.25) v1(18.48,91.24) v1(18.48,90.47) v1(18.86,3.99) v1(18.86,3.23) v1(18.86,2.21) v1(18.86,1.45) v1(19.11,88.06) v1(19.11,87.3) v1(19.11,86.28) v1(19.11,85.52) v1(19.24,93.02) v1(19.24,92.25) v1(19.24,91.24) v1(19.24,90.47) v1(19.75,3.99) v1(19.75,3.23) v1(19.75,2.21) v1(19.75,1.45) v1(19.88,88.06) v1(19.88,87.3) v1(19.88,86.28) v1(19.88,85.52) v1(20.13,93.02) v1(20.13,92.25) v1(20.13,91.24) v1(20.13,90.47) v1(20.51,3.99) v1(20.51,3.23) v1(20.51,2.21) v1(20.51,1.45) v1(20.89,93.02) v1(20.89,92.25) v1(20.89,91.24) v1(20.89,90.47) v1(22.16,45.14) v1(22.16,44.37) v1(22.16,43.36) v1(22.16,42.6) v1(22.93,45.14) v1(22.93,44.37) v1(22.93,43.36) v1(22.93,42.6) v1(23.81,45.14) v1(23.81,44.37) v1(23.81,43.36) v1(23.81,42.6) v1(24.58,45.14) v1(24.58,44.37) v1(24.58,43.36) v1(24.58,42.6) v1(29.65,19.99) v1(29.65,19.23) v1(29.65,18.21) v1(29.65,17.45) v1(30.42,19.99) v1(30.42,19.23) v1(30.42,18.21) v1(30.42,17.45) v1(31.05,4.12) v1(31.05,3.35) v1(31.05,2.34) v1(31.05,1.57) v1(31.3,19.99) v1(31.3,19.23) v1(31.3,18.21) v1(31.3,17.45) v1(31.82,4.12) v1(31.82,3.35) v1(31.82,2.34) v1(31.82,1.57) v1(32.07,19.99) v1(32.07,19.23) v1(32.07,18.21) v1(32.07,17.45) v1(32.7,4.12) v1(32.7,3.35) v1(32.7,2.34) v1(32.7,1.57) v1(33.47,4.12) v1(33.47,3.35) v1(33.47,2.34) v1(33.47,1.57) v1(35.62,37.52) v1(35.62,36.75) v1(35.62,35.74) v1(35.62,34.98) v1(36.39,37.52) v1(36.39,36.75) v1(36.39,35.74) v1(36.39,34.98) v1(37.27,37.52) v1(37.27,36.75) v1(37.27,35.74) v1(37.27,34.98) v1(38.04,37.52) v1(38.04,36.75) v1(38.04,35.74) v1(38.04,34.98) v1(40.89,93.65) v1(40.89,92.89) v1(41.02,89.2) v1(41.02,88.44) v1(41.78,89.2) v1(41.78,88.44) v1(45.27,21.9) v1(45.27,21.13) v1(45.27,20.12) v1(45.27,19.35) v1(45.4,3.99) v1(45.4,3.23) v1(45.4,2.21) v1(45.4,1.45) v1(46.04,21.9) v1(46.04,21.13) v1(46.04,20.12) v1(46.04,19.35) v1(46.17,3.99) v1(46.17,3.23) v1(46.17,2.21) v1(46.17,1.45) v1(46.92,21.9) v1(46.92,21.13) v1(46.92,20.12) v1(46.92,19.35) v1(47.05,3.99) v1(47.05,3.23) v1(47.05,2.21) v1(47.05,1.45) v1(47.69,21.9) v1(47.69,21.13) v1(47.69,20.12) v1(47.69,19.35) v1(47.75,82.98) v1(47.75,82.22) v1(47.82,3.99) v1(47.82,3.23) v1(47.82,2.21) v1(47.82,1.45) v1(48.52,82.98) v1(48.52,82.22) v1(49.91,88.06) v1(49.91,87.3) v1(50.04,90.47) v1(50.04,89.71) v1(50.68,88.06) v1(50.68,87.3) v1(50.8,90.47) v1(50.8,89.71) v1(54.35,88.32) v1(54.35,87.55) v1(54.61,90.6) v1(54.61,89.84) v1(55.12,88.32) v1(55.12,87.55) v1(55.37,90.6) v1(55.37,89.84) v1(55.94,58.22) v1(55.94,57.45) v1(55.94,56.44) v1(55.94,55.68) v1(56.07,72.06) v1(56.07,71.3) v1(56.07,70.28) v1(56.07,69.52) v1(56.32,65.58) v1(56.32,64.82) v1(56.32,63.81) v1(56.32,63.04) v1(56.71,58.22) v1(56.71,57.45) v1(56.71,56.44) v1(56.71,55.68) v1(56.83,72.06) v1(56.83,71.3) v1(56.83,70.28) v1(56.83,69.52) v1(57.09,65.58) v1(57.09,64.82) v1(57.09,63.81) v1(57.09,63.04) v1(57.59,58.22) v1(57.59,57.45) v1(57.59,56.44) v1(57.59,55.68) v1(57.72,72.06) v1(57.72,71.3) v1(57.72,70.28) v1(57.72,69.52) v1(57.97,65.58) v1(57.97,64.82) v1(57.97,63.81) v1(57.97,63.04) v1(58.36,58.22) v1(58.36,57.45) v1(58.36,56.44) v1(58.36,55.68) v1(58.49,72.06) v1(58.49,71.3) v1(58.49,70.28) v1(58.49,69.52) v1(58.74,65.58) v1(58.74,64.82) v1(58.74,63.81) v1(58.74,63.04) v1(59.12,23.8) v1(59.12,23.04) v1(59.12,22.02) v1(59.12,21.26) v1(59.88,23.8) v1(59.88,23.04) v1(59.88,22.02) v1(59.88,21.26) v1(60.77,23.8) v1(60.77,23.04) v1(60.77,22.02) v1(60.77,21.26) v1(61.53,23.8) v1(61.53,23.04) v1(61.53,22.02) v1(61.53,21.26) v1(62.29,3.86) v1(62.29,3.1) v1(62.29,2.08) v1(62.29,1.32) v1(63.06,3.86) v1(63.06,3.1) v1(63.06,2.08) v1(63.06,1.32) v1(63.94,3.86) v1(63.94,3.1) v1(63.94,2.08) v1(63.94,1.32) v1(64.13,71.04) v1(64.13,70.28) v1(64.26,77.27) v1(64.26,76.5) v1(64.39,56.57) v1(64.39,55.8) v1(64.39,51.74) v1(64.39,50.98) v1(64.51,64.44) v1(64.51,63.68) v1(64.58,18.21) v1(64.58,17.45) v1(64.58,16.43) v1(64.58,15.67) v1(64.71,3.86) v1(64.71,3.1) v1(64.71,2.08) v1(64.71,1.32) v1(64.9,71.04) v1(64.9,70.28) v1(65.03,77.27) v1(65.03,76.5) v1(65.15,56.57) v1(65.15,55.8) v1(65.15,51.74) v1(65.15,50.98) v1(65.28,64.44) v1(65.28,63.68) v1(65.34,18.21) v1(65.34,17.45) v1(65.34,16.43) v1(65.34,15.67) v1(65.91,84.25) v1(65.91,83.49) v1(66.1,12.12) v1(66.1,11.35) v1(66.1,10.34) v1(66.1,9.58) v1(66.23,18.21) v1(66.23,17.45) v1(66.23,16.43) v1(66.23,15.67) v1(66.55,45.26) v1(66.68,84.25) v1(66.68,83.49) v1(66.87,12.12) v1(66.87,11.35) v1(66.87,10.34) v1(66.87,9.58) v1(66.99,18.21) v1(66.99,17.45) v1(66.99,16.43) v1(66.99,15.67) v1(67.31,43.61) v1(67.75,12.12) v1(67.75,11.35) v1(67.75,10.34) v1(67.75,9.58) v1(68.2,46.91) v1(68.52,12.12) v1(68.52,11.35) v1(68.52,10.34) v1(68.52,9.58) v1(68.71,45.01) v1(71.37,82.73) v1(71.37,81.97) v1(72.01,74.22) v1(72.01,73.46) v1(72.14,82.73) v1(72.14,81.97) v1(72.71,4.37) v1(72.71,3.61) v1(72.71,2.59) v1(72.71,1.83) v1(72.77,74.22) v1(72.77,73.46) v1(73.28,66.6) v1(73.28,65.84) v1(73.47,4.37) v1(73.47,3.61) v1(73.47,2.59) v1(73.47,1.83) v1(73.59,22.28) v1(73.59,21.51) v1(73.59,20.5) v1(73.59,19.74) v1(74.04,66.6) v1(74.04,65.84) v1(74.36,22.28) v1(74.36,21.51) v1(74.36,20.5) v1(74.36,19.74) v1(74.36,4.37) v1(74.36,3.61) v1(74.36,2.59) v1(74.36,1.83) v1(74.61,58.47) v1(74.61,57.71) v1(74.61,56.69) v1(74.61,55.93) v1(75.12,4.37) v1(75.12,3.61) v1(75.12,2.59) v1(75.12,1.83) v1(75.25,22.28) v1(75.25,21.51) v1(75.25,20.5) v1(75.25,19.74) v1(75.38,58.47) v1(75.38,57.71) v1(75.38,56.69) v1(75.38,55.93) v1(76.01,22.28) v1(76.01,21.51) v1(76.01,20.5) v1(76.01,19.74) v1(76.26,58.47) v1(76.26,57.71) v1(76.26,56.69) v1(76.26,55.93) v1(77.03,58.47) v1(77.03,57.71) v1(77.03,56.69) v1(77.03,55.93) v1(78.36,66.73) v1(78.36,65.96) v1(78.67,39.17) v1(78.67,38.41) v1(78.67,37.39) v1(78.67,36.63) v1(79.12,74.98) v1(79.12,74.22) v1(79.12,66.73) v1(79.12,65.96) v1(79.44,39.17) v1(79.44,38.41) v1(79.44,37.39) v1(79.44,36.63) v1(79.88,74.98) v1(79.88,74.22) v1(80.01,82.73) v1(80.01,81.97) v1(80.33,39.17) v1(80.33,38.41) v1(80.33,37.39) v1(80.33,36.63) v1(80.77,82.73) v1(80.77,81.97) v1(81.09,39.17) v1(81.09,38.41) v1(81.09,37.39) v1(81.09,36.63) v1(83.12,75.62) v1(83.12,74.85) v1(83.12,73.84) v1(83.12,73.08) v1(83.37,67.49) v1(83.37,66.73) v1(83.37,65.71) v1(83.37,64.95) v1(83.63,83.36) v1(83.63,82.6) v1(83.63,81.58) v1(83.63,80.82) v1(83.89,75.62) v1(83.89,74.85) v1(83.89,73.84) v1(83.89,73.08) v1(84.14,67.49) v1(84.14,66.73) v1(84.14,65.71) v1(84.14,64.95) v1(84.39,83.36) v1(84.39,82.6) v1(84.39,81.58) v1(84.39,80.82) v1(84.77,75.62) v1(84.77,74.85) v1(84.77,73.84) v1(84.77,73.08) v1(85.02,67.49) v1(85.02,66.73) v1(85.02,65.71) v1(85.02,64.95) v1(85.28,83.36) v1(85.28,82.6) v1(85.28,81.58) v1(85.28,80.82) v1(85.54,75.62) v1(85.54,74.85) v1(85.54,73.84) v1(85.54,73.08) v1(85.79,67.49) v1(85.79,66.73) v1(85.79,65.71) v1(85.79,64.95) v1(86.04,83.36) v1(86.04,82.6) v1(86.04,81.58) v1(86.04,80.82) v1(88.96,43.99) v1(88.96,43.23) v1(88.96,42.22) v1(88.96,41.45) v1(89.73,43.99) v1(89.73,43.23) v1(89.73,42.22) v1(89.73,41.45) v1(90.61,43.99) v1(90.61,43.23) v1(90.61,42.22) v1(90.61,41.45) v1(90.74,20.24) v1(90.74,19.48) v1(90.74,18.47) v1(90.74,17.7) v1(91.38,43.99) v1(91.38,43.23) v1(91.38,42.22) v1(91.38,41.45) v1(91.51,20.24) v1(91.51,19.48) v1(91.51,18.47) v1(91.51,17.7) v1(91.88,52.12) v1(91.88,51.36) v1(91.88,50.34) v1(91.88,49.58) v1(92.39,20.24) v1(92.39,19.48) v1(92.39,18.47) v1(92.39,17.7) v1(92.45,30.02) v1(92.45,29.26) v1(92.65,52.12) v1(92.65,51.36) v1(92.65,50.34) v1(92.65,49.58) v1(93.22,30.02) v1(93.22,29.26) v1(93.16,20.24) v1(93.16,19.48) v1(93.16,18.47) v1(93.16,17.7) v1(93.53,52.12) v1(93.53,51.36) v1(93.53,50.34) v1(93.53,49.58) v1(94.3,52.12) v1(94.3,51.36) v1(94.3,50.34) v1(94.3,49.58) v1(95.18,5.26) v1(95.18,4.5) v1(95.18,3.48) v1(95.18,2.72) v1(95.95,20.12) v1(95.95,19.35) v1(95.95,18.34) v1(95.95,17.58) v1(95.95,5.26) v1(95.95,4.5) v1(95.95,3.48) v1(95.95,2.72) v1(96.71,20.12) v1(96.71,19.35) v1(96.71,18.34) v1(96.71,17.58) v1(96.84,5.26) v1(96.84,4.5) v1(96.84,3.48) v1(96.84,2.72) v1(97.6,20.12) v1(97.6,19.35) v1(97.6,18.34) v1(97.6,17.58) v1(97.6,5.26) v1(97.6,4.5) v1(97.6,3.48) v1(97.6,2.72) v1(98.36,20.12) v1(98.36,19.35) v1(98.36,18.34) v1(98.36,17.58)
ADC0: length 59.5
  Top Layer w0.508: 声音传感器.1 72.89,90.35 67.44,90.35 50.29,73.2 50.29,52.76 46.86,49.33 U1.25
ADC1: length 51.1
  Top Layer w0.508: 雨滴传感器.1 60.32,88.44 46.1,74.22 46.1,50.34 U1.26
ADC2: length 45.4
  Top Layer w0.508: U1.27 43.94,50.72 光照传感器.1
AIN1: length 21.2
  Top Layer w0.508: U1.30 35.56,49.96 U3.11
AIN2: length 21.2
  Top Layer w0.508: U1.29 38.1,49.96 U3.10
AO1: length 12.2
  Top Layer w1.27: U3.4 33.02,97.46 电机输出.4
AO2: length 12.2
  Top Layer w1.27: 电机输出.3 30.48,97.46 U3.5
BIN1: length 21
  Top Layer w0.508: U3.13 30.48,49.71 U1.31
BIN2: length 21
  Top Layer w0.508: U3.14 27.94,49.71 U1.32
BO1: length 12.2
  Top Layer w1.27: 电机输出.1 25.4,97.46 U3.7
BO2: length 12.2
  Top Layer w1.27: U3.6 27.94,97.46 电机输出.2
COOL: length 60
  Bottom Layer w0.254: R6.2 17.65,62.94 17.65,43.23 21.34,39.55 48.39,39.55 49.4,38.53 U1.17
ESP_RX: length 71.6
  Top Layer w0.508: U1.6 21.46,31.67 24.26,28.88 62.23,28.88 esp8266.4
ESP_TX: length 75
  Top Layer w0.508: U1.7 24,32.69 26.29,30.4 70.87,30.4 esp8266.5
HOST: length 53.9
  Bottom Layer w0.254: U1.16 46.86,38.02 46.35,38.53 19.56,38.53 15.11,42.98 15.11,56.17 R5.2
I2C1_SCL: length 50.1
  Top Layer w0.508: U1.14 48.77,40.31 71.75,40.31 OLED1.3
I2C1_SDA: length 50.1
  Top Layer w0.508: OLED1.4 72.39,38.41 49.4,38.41 U1.15
LED1: length 92.6
  Top Layer w0.508: U1.5 22.22,36.63 27.18,36.63 36.96,46.41 63.88,46.41 66.55,49.07 66.55,81.1 R1.2
LED2: length 78.7
  Top Layer w0.508: R2.2 67.94,74.75 67.94,47.93 65.28,45.26 38.48,45.26 U1.8
LED3: length 69.9
  Top Layer w0.508: R3.2 71.23,70.14 69.72,68.63 69.72,47.3 65.79,43.36 39.12,43.36 U1.9
LED4: length 53.2
  Top Layer w0.508: U1.13 47.88,41.96 66.8,41.96 71.23,46.39 R4.2
PWMA: length 21.2
  Top Layer w0.508: U3.9 40.64,49.96 U1.28
PWMB: length 21
  Top Layer w0.508: U3.15 25.4,49.71 U1.33
RELAY_AC: length 51.9
  Top Layer w0.508: U1.36 18.92,78.03 4.85,92.1 继电器.3
RELAY_RC: length 56.4
  Top Layer w0.508: U1.35 21.46,78.92 4.78,95.6 继电器.4
SERVO_IO: length 51.8
  Top Layer w0.254: 舵机.1 24,90.98 U1.34
SW1: length 25.9
  Top Layer w0.254: SW3.2 SW3.1
  Top Layer w0.508: U1.1 8.76,14.57 SW3.1
SW2: length 30.7
  Top Layer w0.254: SW4.1 SW4.2
  Top Layer w0.508: U1.2 23.29,21.34 SW4.1
SW3: length 43.2
  Top Layer w0.254: SW6.1 SW6.2
  Top Layer w0.508: U1.3 23.88,23.29 36.45,23.29 38.28,21.46 SW6.1
SW4: length 56.5
  Top Layer w0.254: SW7.1 SW7.2
  Top Layer w0.508: SW7.1 53.26,22.86 50.04,26.09 23.62,26.09 U1.4
TEMP_DATA: length 74
  Top Layer w0.508: U1.22 54.48,74.98 68.58,89.08 91.31,89.08 92.47,90.24 92.47,93.55
$1N176: length 8.4
  Top Layer w0.762: R4.1 厕所灯.1
$1N177: length 8.4
  Top Layer w0.762: 卧室3灯.1 89.78,70.16 R3.1
$1N178: length 8.5
  Top Layer w0.762: 卧室1灯.1 89.76,85.65 R1.1
$1N179: length 8.5
  Top Layer w0.762: R2.1 卧室2灯.1
$1N193: length 2.8
  Top Layer w0.508: 制冷.1 3.81,57.71 6.46,57.71
$1N194: length 2.8
  Top Layer w0.508: 6.46,63.93 3.81,63.93 制热.1

## Copper pours and planes (outline as drawn; the poured copper is in the pictures)
GND on Top Layer: -10.41,108.64 143.64,108.64 143.64,-16.08 -10.41,-16.08
GND on Bottom Layer: -18.54,115.75 160.91,115.75 160.91,-25.09 -18.54,-25.09

Small or netless copper shapes (teardrops, artwork), in the pictures only: 109 on Top Layer, 12 on Bottom Layer
